# Altium schematic sheet Power.SchDoc
size A2; SheetNumber: 2; SheetTotal: 7
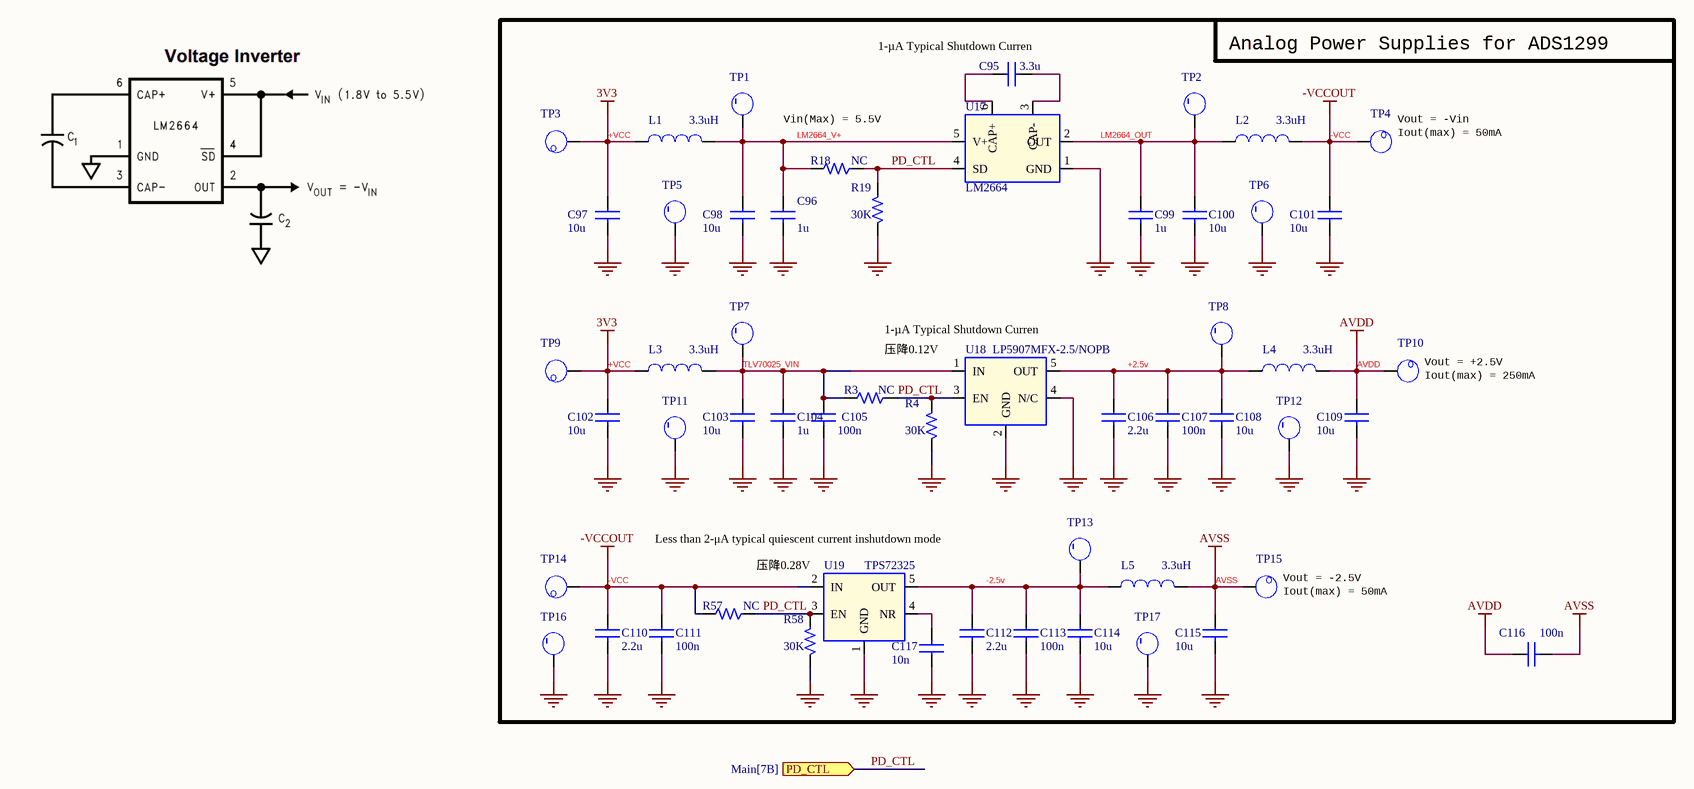
[diagram p0: Power.SchDoc]

## Parts
C95  3.3u  [0402_C]
C96  1u  [0402_C]
C97  10u  [0402_C]
C98  10u  [0402_C]
C99  1u  [0402_C]
C100  10u  [0402_C]
C101  10u  [0402_C]
C102  10u  [0402_C]
C103  10u  [0402_C]
C104  1u  [0402_C]
C105  100n  [0402_C]
C106  2.2u  [0402_C]
C107  100n  [0402_C]
C108  10u  [0402_C]
C109  10u  [0402_C]
C110  2.2u  [0402_C]
C111  100n  [0402_C]
C112  2.2u  [0402_C]
C113  100n  [0402_C]
C114  10u  [0402_C]
C115  10u  [0402_C]
C116  100n  [0201_C]
C117  10n  [0402_C]
L1  3.3uH  [0805_L]
L2  3.3uH  [0805_L]
L3  3.3uH  [0805_L]
L4  3.3uH  [0805_L]
L5  3.3uH  [0805_L]
R3  NC  [0402_R]
R4  30K  [0402_R]
R18  NC  [0402_R]
R19  30K  [0402_R]
R57  NC  [0402_R]
R58  30K  [0402_R]
TP1  SMD_TP_C35  [TEST_Point]  (value not drawn)
TP2  SMD_TP_C35  [TEST_Point]  (value not drawn)
TP3  SMD_TP_C35  [TEST_Point]  (value not drawn)
TP4  SMD_TP_C35  [TEST_Point]  (value not drawn)
TP5  SMD_TP_C35  [TEST_Point]  (value not drawn)
TP6  SMD_TP_C35  [TEST_Point]  (value not drawn)
TP7  SMD_TP_C35  [TEST_Point]  (value not drawn)
TP8  SMD_TP_C35  [TEST_Point]  (value not drawn)
TP9  SMD_TP_C35  [TEST_Point]  (value not drawn)
TP10  SMD_TP_C35  [TEST_Point]  (value not drawn)
TP11  SMD_TP_C35  [TEST_Point]  (value not drawn)
TP12  SMD_TP_C35  [TEST_Point]  (value not drawn)
TP13  SMD_TP_C35  [TEST_Point]  (value not drawn)
TP14  SMD_TP_C35  [TEST_Point]  (value not drawn)
TP15  SMD_TP_C35  [TEST_Point]  (value not drawn)
TP16  SMD_TP_C35  [TEST_Point]  (value not drawn)
TP17  SMD_TP_C35  [TEST_Point]  (value not drawn)
U17  LM2664  [SOT-23-6]
U18  LP5907MFX-2.5/NOPB  [SOT-23_5]
U19  TPS72325  [SOT-23_5]

## Ports
PD_CTL (in, see Main[7B])

## Nets
+VCC: C97.1 C102.1 L1.1 L3.1 TP3.1 TP9.1  [also labelled 3V3]
-VCC: C101.1 C110.1 C111.1 L2.2 R57.2 TP4.1 TP14.1 U19.2(IN)  [also labelled -VCCOUT]
AVDD: C109.1 C116.1 L4.2 TP10.1
AVSS: C115.1 C116.2 L5.2 TP15.1
GND: C96.2 C97.2 C98.2 C99.2 C100.2 C101.2 C102.2 C103.2 C104.2 C105.2 C106.2 C107.2 C108.2 C109.2 C110.2 C111.2 C112.2 C113.2 C114.2 C115.2 C117.1 R4.2 R19.2 R58.2 TP5.1 TP6.1 TP11.1 TP12.1 TP16.1 TP17.1 U17.1(GND) U18.2(GND) U18.4(N/C) U19.1(GND)
+2.5v: C106.1 C107.1 C108.1 L4.1 TP8.1 U18.5(OUT)
-2.5v: C112.1 C113.1 C114.1 L5.1 TP13.1 U19.5(OUT)
LM2664_OUT: C99.1 C100.1 L2.1 TP2.1 U17.2(OUT)
LM2664_V+: C96.1 C98.1 L1.2 R18.2 TP1.1 U17.5(V+)
PD_CTL: R3.1 R4.1 R18.1 R19.1 R57.1 R58.1 U17.4(SD) U18.3(EN) U19.3(EN) ; port PD_CTL
TLV70025_VIN: C103.1 C104.1 C105.1 L3.2 R3.2 TP7.1 U18.1(IN)
NetC95_1: C95.1 U17.6(CAP+)
NetC95_2: C95.2 U17.3(CAP-)
NetC117_2: C117.2 U19.4(NR)

## Notes on the sheet
- (near C95) 1-µA Typical Shutdown Curren
- Analog Power Supplies for ADS1299
- Vin(Max) = 5.5V
- (near TP4) Vout = -Vin
- (near TP4) Iout(max) = 50mA
- (near U18) 1-µA Typical Shutdown Curren
- 压降0.12V
- (near TP10) Iout(max) = 250mA
- (near TP10) Vout = +2.5V
- (near U19) Less than 2-μA typical quiescent current inshutdown mode
- 压降0.28V
- (near TP15) Vout = -2.5V
- (near TP15) Iout(max) = 50mA

## Library data of the parts
C95 = CAP0402: CAP CER 3.3UF 10V X5R 0805; Part Number: GRM21BR61A335KA73L; Manufacturer: Murata Electronics; FPLIST: 0402_smd; PCB Footprint: C0805; Distributor: LCSC; Distributor Part Number: C162416; Distributor Link: https://item.szlcsc.com/173797.html; Manufacturer Part Number: GRM21BR61A335KA73L
C96 C99 C104 = CAP0402: CAP CER 1UF 25V X5R 0603; Part Number: GRM188R61E105KA12D; Manufacturer: Murata Electronics; FPLIST: 0402_smd; PCB Footprint: C0603; Distributor: LCSC; Distributor Part Number: C77046; Distributor Link: https://item.szlcsc.com/78173.html; Manufacturer Part Number: GRM188R61E105KA12D
C97 C98 C100-C103 C108 C109 C114 C115 = CAP0402: CAP CER 10UF 10V X5R 0603; Part Number: CL10A106KP8NNNC; Manufacturer: Samsung Electro-Mechanics; FPLIST: 0402_smd; PCB Footprint: C0603; Distributor: LCSC; Distributor Part Number: C19702; Distributor Link: https://item.szlcsc.com/20411.html; Manufacturer Part Number: CL10A106KP8NNNC
C105 C107 C111 C113 C116 = CAP0402: CAP CER 0.1UF 25V X7R 0402; Part Number: CC0402KRX7R8BB104; Manufacturer: YAGEO; FPLIST: 0402_smd; PCB Footprint: C0402; Distributor: LCSC; Distributor Part Number: C105883; Distributor Link: https://item.szlcsc.com/107098.html; Manufacturer Part Number: CC0402KRX7R8BB104
C106 C110 C112 = CAP0402: CAP CER 2.2UF 25V X5R 0603; Part Number: CC0603KRX5R8BB225; Manufacturer: YAGEO; FPLIST: 0402_smd; PCB Footprint: C0603; Distributor: LCSC; Distributor Part Number: C541409; Distributor Link: https://item.szlcsc.com/293094.html; Manufacturer Part Number: CC0603KRX5R8BB225
C117 = CAP0402: CAP CER 10000PF 25V X7R 0402; Part Number: CC0402KRX7R8BB103; Manufacturer: YAGEO; FPLIST: 0402_smd; PCB Footprint: C0402; Distributor: LCSC; Distributor Part Number: C327025; Distributor Link: https://item.szlcsc.com/307119.html; Manufacturer Part Number: CC0402KRX7R8BB103
L1 L5 = INDUCTOR: FIXED IND 3.3UH 500MA 260 MOHM; Part Number: KLZ2012MHR3R3HTD25; Manufacturer: TDK Corporation; PCB Footprint: L0805; Distributor Link: https://item.szlcsc.com/391913.html; Distributor: LCSC; Manufacturer Part Number: KLZ2012MHR3R3HTD25; Distributor Part Number: C404386
L2-L4 = INDUCTOR: FIXED IND 3.3UH 500MA 260 MOHM; Manufacturer: TDK Corporation; Manufacturer Part Number: KLZ2012MHR3R3HTD25; PCB Footprint: L0805; Distributor Part Number: C404386; Distributor: LCSC; Part Number: KLZ2012MHR3R3HTD25; Distributor Link: https://item.szlcsc.com/391913.html
R3 R18 R57 = RES: RES SMD 0 OHM JUMPER 1/16W 0402; Part Number: RC0402FR-070RL; Manufacturer: YAGEO; PCB Footprint: R0402; Distributor Link: https://item.szlcsc.com/107446.html; Distributor: LCSC; Distributor Part Number: C106231; Manufacturer Part Number: RC0402FR-070RL
R4 R19 R58 = RES: PCB Footprint: R0402
TP1-TP17 = CON1_0: PCB Footprint: SMD_TP_C35; Part Type: TP
U17 = LM2664: IC REG CHARG PUMP INV 40MA SOT23; Manufacturer Part Number: LM2664M6X/NOPB; Manufacturer: Texas Instruments; PCB Footprint: SOT_23_6_DBV; Distributor Part Number: C108573; Distributor: LCSC; Part Number: LM2664M6X/NOPB; Distributor Link: https://item.szlcsc.com/109792.html
U18 = LP5907: IC REG LINEAR 2.5V 250MA SOT23-5; Manufacturer: Texas Instruments; PCB Footprint: SOT_23_5_DBV; Distributor Link: https://item.szlcsc.com/176514.html; Manufacturer Part Number: LP5907MFX-2.5/NOPB; Distributor: LCSC; Part Number: LP5907MFX-2.5/NOPB; Distributor Part Number: C165132
U19 = TPS72325: IC REG LIN -2.5V 200MA SOT23-5; Manufacturer Part Number: TPS72325DBVR; Manufacturer: Texas Instruments; PCB Footprint: SOT_23_5_DBV; Distributor Link: https://item.szlcsc.com/71027.html; Distributor: LCSC; Part Number: TPS72325DBVR; Distributor Part Number: C69932